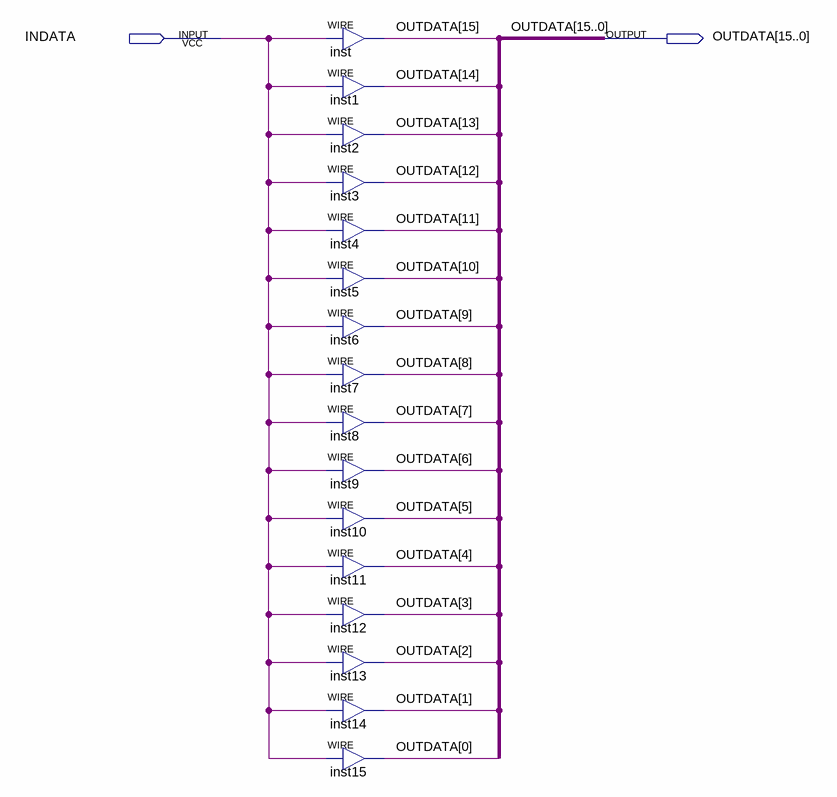
[diagram p0: schematic sheet]
// Quartus schematic wb_mul_extend16.bdf as structural Verilog: 16 symbols, 2 pins
module wb_mul_extend16 (
  input  INDATA,
  output [15:0] OUTDATA
);

  assign OUTDATA[15] = INDATA;  // WIRE inst
  assign OUTDATA[14] = INDATA;  // WIRE inst1
  assign OUTDATA[13] = INDATA;  // WIRE inst2
  assign OUTDATA[12] = INDATA;  // WIRE inst3
  assign OUTDATA[11] = INDATA;  // WIRE inst4
  assign OUTDATA[10] = INDATA;  // WIRE inst5
  assign OUTDATA[9] = INDATA;  // WIRE inst6
  assign OUTDATA[8] = INDATA;  // WIRE inst7
  assign OUTDATA[7] = INDATA;  // WIRE inst8
  assign OUTDATA[6] = INDATA;  // WIRE inst9
  assign OUTDATA[5] = INDATA;  // WIRE inst10
  assign OUTDATA[4] = INDATA;  // WIRE inst11
  assign OUTDATA[3] = INDATA;  // WIRE inst12
  assign OUTDATA[2] = INDATA;  // WIRE inst13
  assign OUTDATA[1] = INDATA;  // WIRE inst14
  assign OUTDATA[0] = INDATA;  // WIRE inst15
endmodule
